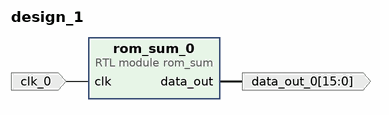
[diagram p0: block diagram of the top level]
# Vivado block design design_1, xc7a100tcsg324-3, Vivado 2018.2
create_bd_design design_1

create_bd_port -dir I -type clk clk_0
create_bd_port -dir O -from 15 -to 0 data_out_0

create_bd_cell -type module -reference rom_sum rom_sum_0

# ---- connections ----

connect_bd_net -net clk_0_1 [get_bd_ports clk_0] [get_bd_pins rom_sum_0/clk]
connect_bd_net [get_bd_pins rom_sum_0/data_out] [get_bd_ports data_out_0]

validate_bd_design
save_bd_design
